# Altium schematic sheet teensy.SchDoc
size A; SheetNumber: 4; SheetTotal: 4
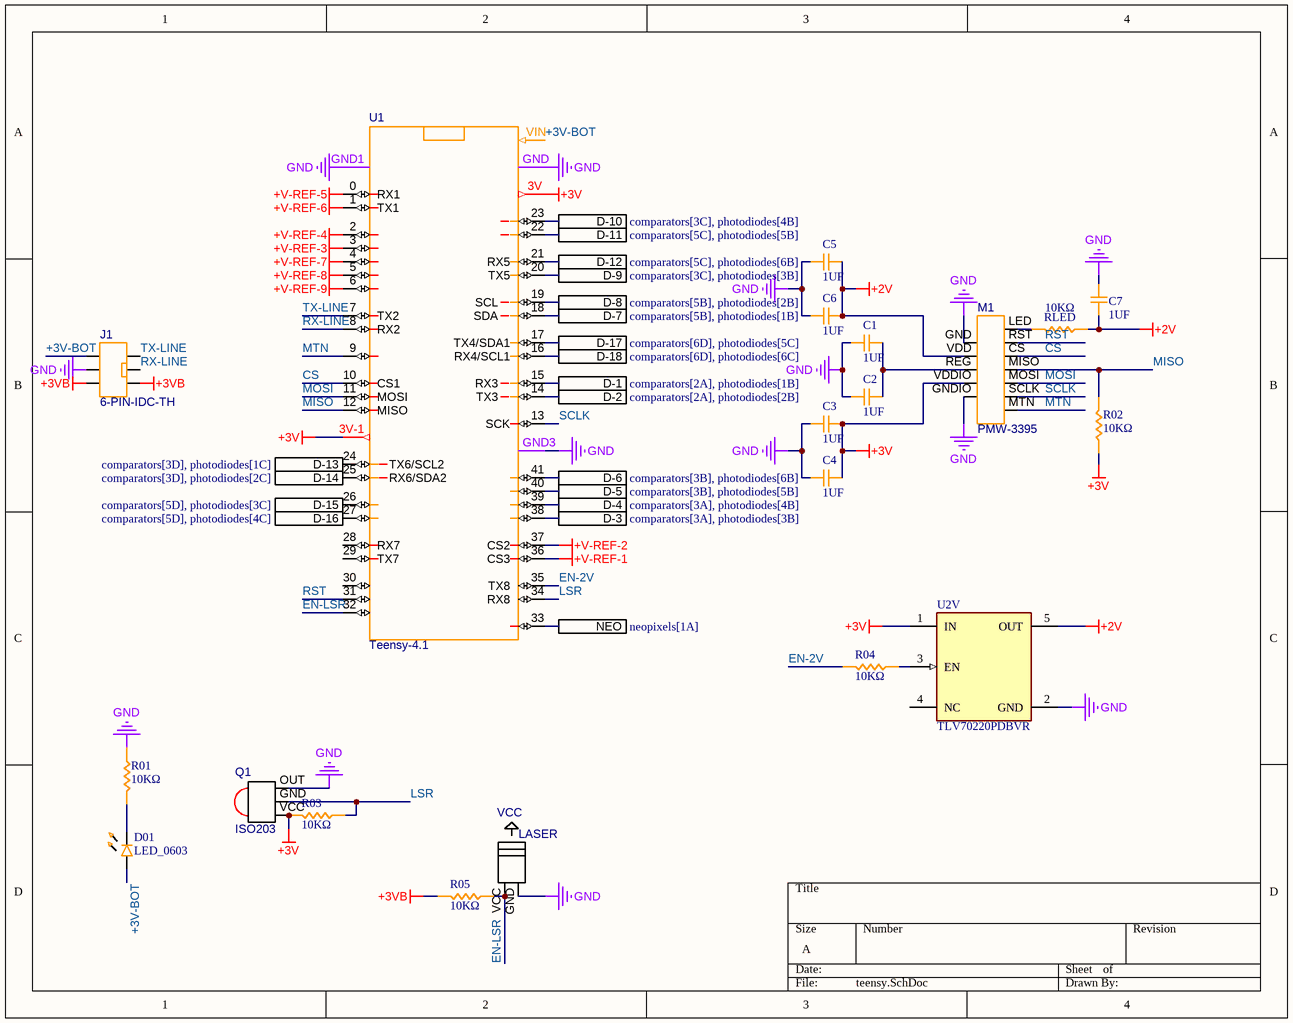
[diagram p0: teensy.SchDoc]

## Parts
C1  1UF  [CAP_0603]
C2  1UF  [CAP_0603]
C3  1UF  [CAP_0603]
C4  1UF  [CAP_0603]
C5  1UF  [CAP_0603]
C6  1UF  [CAP_0603]
C7  1UF  [CAP_0603]
D01  LED_0603  [LED_0603]
J1  6-PIN-IDC-TH  [6-PIN-IDC-TH]
M1  PMW-3395  [MOUSE-DIP16]
Q1  ISO203  [TSSP-58038]
R01  10KΩ  [RES_0603]
R02  10KΩ  [RES_0603]
R03  10KΩ  [RES_0603]
R04  10KΩ  [RES_0603]
R05  10KΩ  [RES_0603]
RLED  10KΩ  [RES_0603]
U1  Teensy-4.1  [Teensy-4.1]
U2V  TLV70220PDBVR  [FP-DBV0005A-MFG]
VCC  LASER  [LASER]

## Ports
D-1 (see comparators[2A], photodiodes[1B]), D-2 (see comparators[2A], photodiodes[2B]), D-3 (see comparators[3A], photodiodes[3B]), D-4 (see comparators[3A], photodiodes[4B]), D-5 (see comparators[3B], photodiodes[5B]), D-6 (see comparators[3B], photodiodes[6B]), D-7 (see comparators[5B], photodiodes[1B]), D-8 (see comparators[5B], photodiodes[2B]), D-9 (see comparators[3C], photodiodes[3B]), D-10 (see comparators[3C], photodiodes[4B]), D-11 (see comparators[5C], photodiodes[5B]), D-12 (see comparators[5C], photodiodes[6B]), D-13 (see comparators[3D], photodiodes[1C]), D-14 (see comparators[3D], photodiodes[2C]), D-15 (see comparators[5D], photodiodes[3C]), D-16 (see comparators[5D], photodiodes[4C]), D-17 (see comparators[6D], photodiodes[5C]), D-18 (see comparators[6D], photodiodes[6C]), NEO (see neopixels[1A])

## Nets
+2V: C5.1 C6.1 C7.1 M1.VDD RLED.2 U2V.5(OUT)
+3V: C3.2 C4.2 M1.VDDIO Q1.VCC R02.2 R03.1 U1.3V U1.3V-1 U2V.1(IN)
+3VB: J1.3 J1.4 R05.1
+V-REF-1: U1.36(CS3)
+V-REF-2: U1.37(CS2)
+V-REF-3: U1.3
+V-REF-4: U1.2
+V-REF-5: U1.0(RX1)
+V-REF-6: U1.1(TX1)
+V-REF-7: U1.4
+V-REF-8: U1.5
+V-REF-9: U1.6
GND: C1.1 C2.1 C3.1 C4.1 C5.2 C6.2 C7.2 J1.2 M1.GND M1.GNDIO Q1.OUT R01.2 U1.GND U1.GND1 U1.GND3 U2V.2(GND) VCC.GND
+3V-BOT: D01.A J1.1 U1.VIN
CS: M1.CS U1.10(CS1)
D-1: U1.15(RX3) ; port D-1
D-2: U1.14(TX3) ; port D-2
D-3: U1.38 ; port D-3
D-4: U1.39 ; port D-4
D-5: U1.40 ; port D-5
D-6: U1.41 ; port D-6
D-7: U1.18(SDA) ; port D-7
D-8: U1.19(SCL) ; port D-8
D-9: U1.20(TX5) ; port D-9
D-10: U1.23 ; port D-10
D-11: U1.22 ; port D-11
D-12: U1.21(RX5) ; port D-12
D-13: U1.24(TX6/SCL2) ; port D-13
D-14: U1.25(RX6/SDA2) ; port D-14
D-15: U1.26 ; port D-15
D-16: U1.27 ; port D-16
D-17: U1.17(TX4/SDA1) ; port D-17
D-18: U1.16(RX4/SCL1) ; port D-18
EN-2V: R04.1 U1.35(TX8)
EN-LSR: R05.2 U1.32 VCC.VCC
LSR: Q1.GND R03.2 U1.34(RX8)
MISO: M1.MISO R02.1 U1.12(MISO)
MOSI: M1.MOSI U1.11(MOSI)
MTN: M1.MTN U1.9
NEO: U1.33 ; port NEO
RST: M1.RST U1.31
RX-LINE: J1.5 U1.8(RX2)
SCLK: M1.SCLK U1.13(SCK)
TX-LINE: J1.6 U1.7(TX2)
NetC1_2: C1.2 C2.2 M1.REG
NetD01_C: D01.C R01.1
NetM1_LED: M1.LED RLED.1
NetR04_2: R04.2 U2V.3(EN)

Not connected (* = marked no-connect by the designer): U1 28(RX7) 29(TX7) 30; U2V 4(NC)

## Library data of the parts
C1-C7 = CAP_0603: Capacitor SMD 0603 generic
Q1 = TSSP-58038
R01 R02 R03 R04 R05 RLED = RES_0603: Resistor SMD 0603 generic
U2V = CMP-0394-00506-3: IC REG LINEAR 2V 300MA SOT23-5; Manufacturer: Texas Instruments; Number Of Outputs: 1; Max Junction Temp: +125°C; Max Supply Voltage: 5.5V; Ciiva Ids: 1503676; Standoff Height: 0mm; Dropout Voltage: 260mV; Output Type: Fixed; Accuracy Percentage: 0.5%; Import Ts: 1521850062; Output Voltage: 2V; Temperature Range High: +125°C; Lead Free: Yes; Digikey Description: IC REG LINEAR 2V 300MA SOT23-5; Release Date: 1464578725; Manufacturer Part Number: TLV70220PDBVR; Category: IC; Octopart: https://octopart.com/tlv70220pdbvr-texas+instruments-20023687; RoHS: TRUE; Automotive: No; Output Current: 300mA; ComponentLink2Description: Datasheet; Device Class L3: Voltage Regulators - Linear; ComponentLink2URL: http://www.ti.com/lit/ds/symlink/tlv702p.pdf; Mouser Description: LDO Voltage Regulators 300mA,Low IQ,LDO Reg; Package: DBV0005A; Height: 1.45mm; Min Supply Voltage: 2V; Device Class L2: Power Management ICs; Device Class L1: Integrated Circuits (ICs); Temperature: -40°C to +125°C; Temperature Range Low: -40°C